# EAGLE design LocoNet-DCC Interface v2.0 (EAGLE 7.5.0)
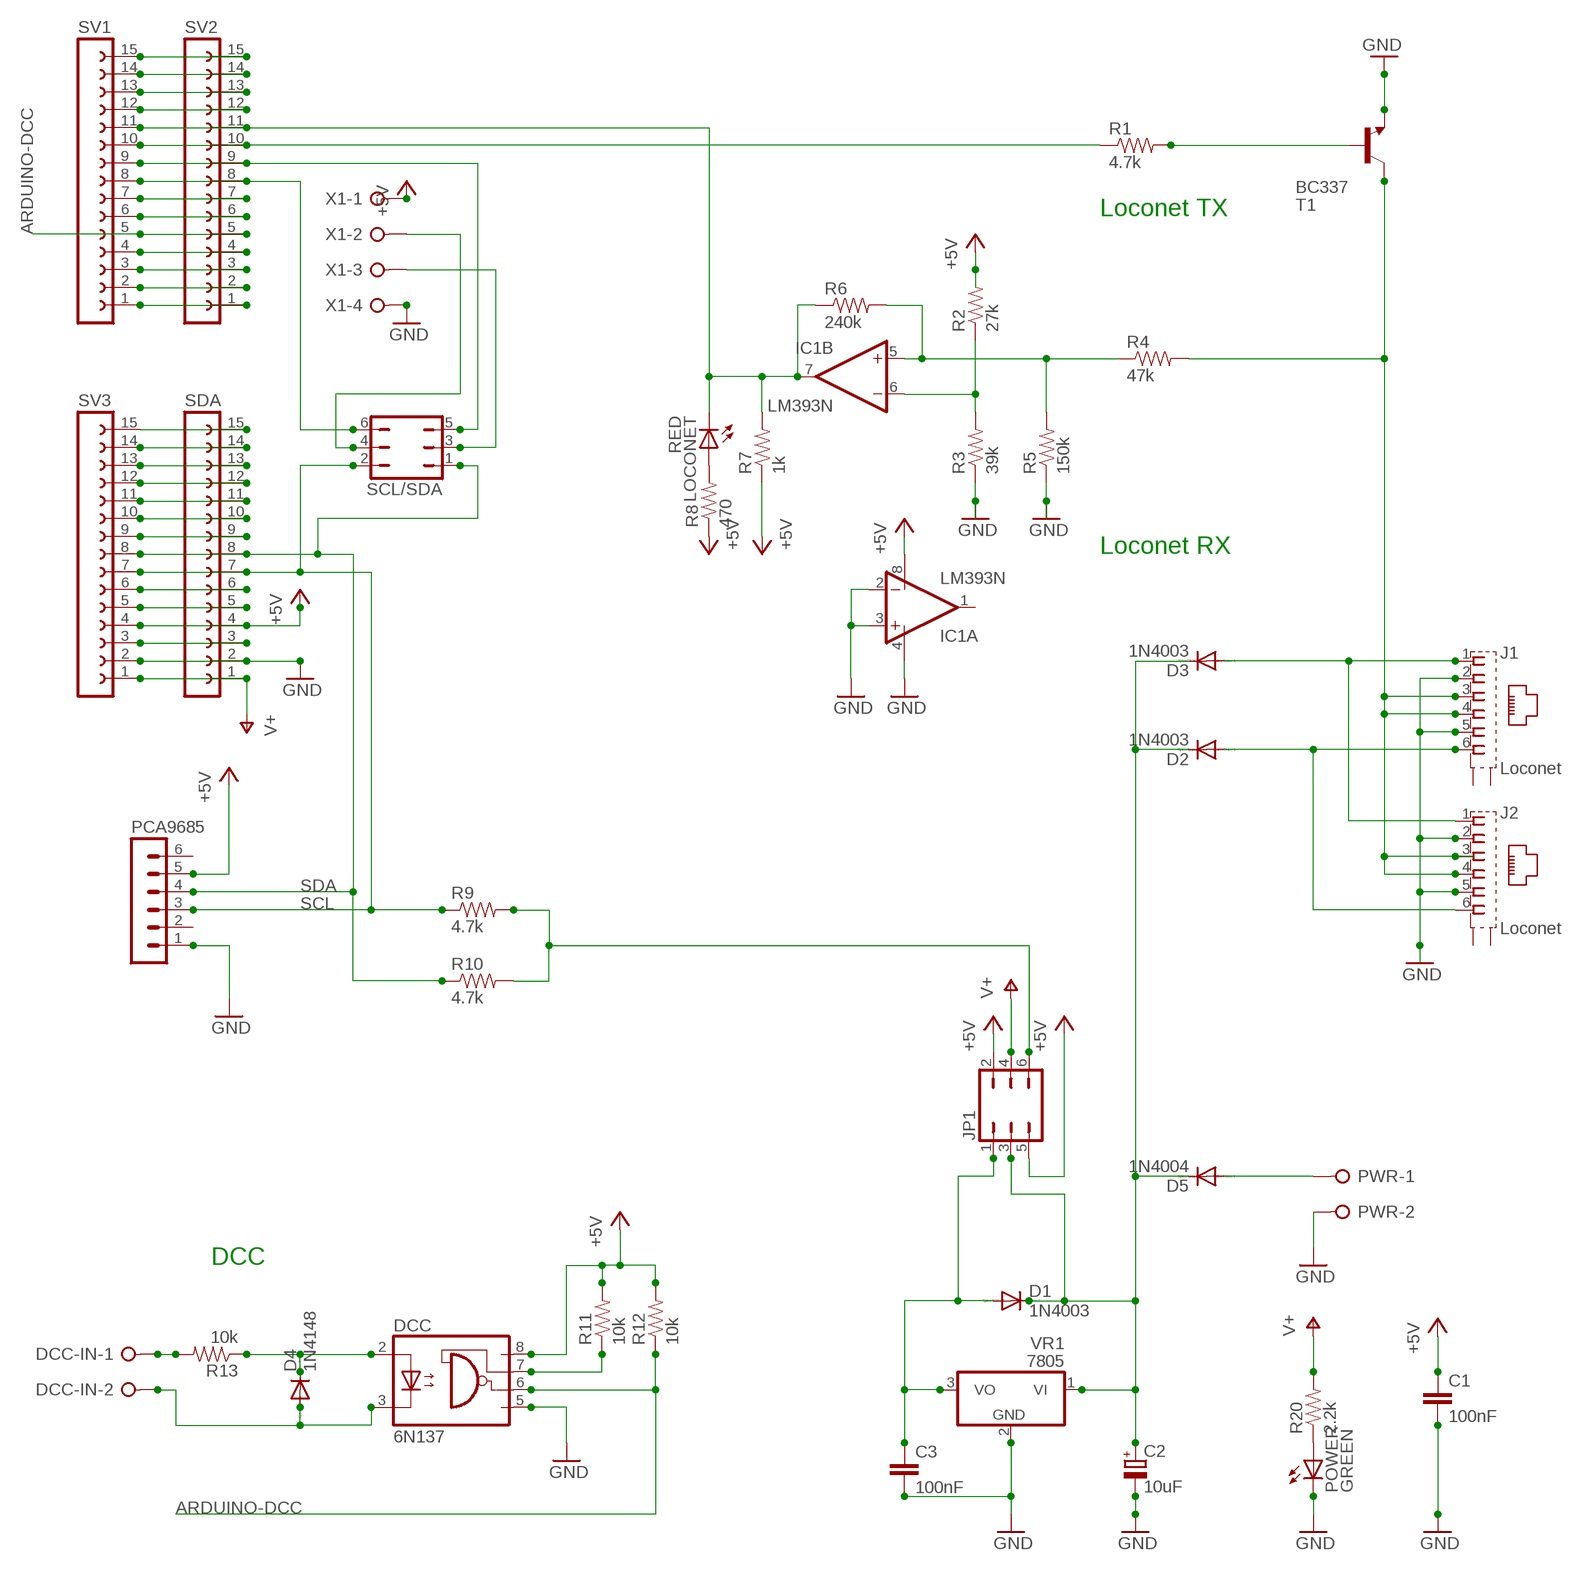
[diagram p0: schematic, sheet 1]

## Parts
C1  100nF  C-EU025_050-025X075  [C025_050-025X075]
C2  10uF  CPOL-EUE2.5-6  [E2,5-6]
C3  100nF  C-EU025_050-025X075  [C025_050-025X075]
D1  1N4003  1N4004  [DO41-10]
D2  1N4003  1N4004  [DO41-10]
D3  1N4003  1N4004  [DO41-10]
D4  1N4148  1N4148DO35-7  [DO35-7]
D5  1N4004  [DO41-10]
DCC  6N137  [DIL08]
DCC-IN  W237-02P  [W237-132]
IC1  LM393N  [DIL08]
J1  Loconet  555140-1  [555140-1]
J2  Loconet  555140-1  [555140-1]
JP1  JP3Q  [JP3Q]
LOCONET  RED  LED3MM  [LED3MM]
PCA9685  MA06-1  [MA06-1]
POWER  GREEN  LED3MM  [LED3MM]
PWR  W237-02P  [W237-132]
R1  4.7k  RESISTORAXIAL-0.3  [AXIAL-0.3]
R2  27k  RESISTORAXIAL-0.3  [AXIAL-0.3]
R3  39k  RESISTORAXIAL-0.3  [AXIAL-0.3]
R4  47k  RESISTORAXIAL-0.3  [AXIAL-0.3]
R5  150k  RESISTORAXIAL-0.3  [AXIAL-0.3]
R6  240k  RESISTORAXIAL-0.3  [AXIAL-0.3]
R7  1k  RESISTORAXIAL-0.3  [AXIAL-0.3]
R8  470  RESISTORAXIAL-0.3  [AXIAL-0.3]
R9  4.7k  RESISTORAXIAL-0.3  [AXIAL-0.3]
R10  4.7k  RESISTORAXIAL-0.3  [AXIAL-0.3]
R11  10k  RESISTORAXIAL-0.3  [AXIAL-0.3]
R12  10k  RESISTORAXIAL-0.3  [AXIAL-0.3]
R13  10k  RESISTORAXIAL-0.3  [AXIAL-0.3]
R20  2.2k  RESISTORAXIAL-0.3  [AXIAL-0.3]
SCL/SDA  JP3Q  [JP3Q]
SDA  FE15-1NOTEXT  [FE15]
SV1  FE15-1NOTEXT  [FE15]
SV2  FE15-1NOTEXT  [FE15]
SV3  FE15-1NOTEXT  [FE15]
T1  BC337  [TO92]
VR1  7805  7805TV  [TO220V]
X1  W237-04P  [W237-4P]

## Nets
3V3: SDA.14 SV3.14
+5V [5v]: C1.1 DCC.8(VCC) IC1.8(P:V+) JP1.2 JP1.5 PCA9685.5 R2.P$2 R7.P$1 R8.P$1 R11.P$2 R12.P$2 SDA.4 SV3.4 X1.1
A0: SDA.12 SV3.12
A1: SDA.11 SV3.11
A2: SDA.10 SV3.10
A3: SDA.9 SV3.9
A6: SDA.6 SV3.6
A7: SDA.5 SV3.5
ARDUINO-DCC: DCC.6(VO) R12.P$1 SV1.5 SV2.5
AREF: SDA.13 SV3.13
GND [ground]: C1.2 C2.- C3.2 DCC.5(GND) IC1.2(A:-IN) IC1.3(A:+IN) IC1.4(P:V-) J1.2 J1.5 J2.2 J2.5 PCA9685.1 POWER.K(C) PWR.2 R3.P$1 R5.P$1 SDA.2 SV3.2 T1.1(E) VR1.2(GND) X1.4
I2C_PULLUP: JP1.6 R9.P$2 R10.P$2
L-RX: IC1.7(B:OUT) LOCONET.K(C) R6.P$1 R7.P$2 SV1.11 SV2.11
L-TX: R1.P$1 SV1.10 SV2.10
LOCONET-SIGNAL [Loconet]: J1.3 J1.4 J2.3 J2.4 R4.P$2 T1.3(C)
N$1 [Vin]: D5.A PWR.1
N$5: POWER.A R20.P$1
N$7: LOCONET.A R8.P$2
N$8: R1.P$2 T1.2(B)
N$10: IC1.6(B:-IN) R2.P$1 R3.P$2
N$11: IC1.5(B:+IN) R4.P$1 R5.P$2 R6.P$2
N$14: SDA.3 SV3.3
N$30: SV1.4 SV2.4
N$37 [DCC]: D4.C DCC.2(A) R13.P$1
N$42 [DCC]: D4.A DCC-IN.2 DCC.3(C)
N$43: DCC.7(VE) R11.P$1
N$45 [DCC]: DCC-IN.1 R13.P$2
PIN3: SV1.6 SV2.6
PIN4: SV1.7 SV2.7
PIN5: SCL/SDA.6 SV1.8 SV2.8
PIN6: SCL/SDA.5 SV1.9 SV2.9
PIN9: SV1.12 SV2.12
PIN10: SV1.13 SV2.13
PIN11: SV1.14 SV2.14
PIN12: SV1.15 SV2.15
PIN13: SDA.15 SV3.15
RAILSYNC-A [Vin]: D3.A J1.1 J2.1
RAILSYNC-B [Vin]: D2.A J1.6 J2.6
RAILSYNC-VIN [Vin]: C2.+ D1.C D2.C D3.C D5.C JP1.3 VR1.1(VI)
RESET: SV1.3 SV2.3
RXD: SV1.2 SV2.2
SCL: PCA9685.3 R9.P$1 SCL/SDA.2 SDA.7 SV3.7
SDA: PCA9685.4 R10.P$1 SCL/SDA.1 SDA.8 SV3.8
TXD: SV1.1 SV2.1
V-OUT [5v]: C3.1 D1.A JP1.1 VR1.3(VO)
VIN [Vin]: JP1.4 R20.P$2 SDA.1 SV3.1 ; supply symbol labelled V+
X1-SCL/D5: SCL/SDA.4 X1.2
X1-SDA/D6: SCL/SDA.3 X1.3
Unconnected: IC1.1(A:OUT) J1.G1(S1) J1.G2(S2) J2.G1(S1) J2.G2(S2) PCA9685.2 PCA9685.6

## Notes on the sheet
- Loconet TX
- Loconet RX
- DCC

## Library data of the parts
C1 C3 = rcl:C-EU: CAPACITOR, European symbol
C2 = rcl:CPOL-EU: POLARIZED CAPACITOR, European symbol
D1-D3 D5 = diode:1N4004: DIODE general purpose rectifier, 1 A
D4 = diode:1N4148: DIODE high speed (Philips)
DCC = optocoupler:6N137: MOTOROLA OPTO COUPLER; MPN: 6N137; OC_FARNELL: 1328376; OC_NEWARK: 52M1895
DCC-IN PWR = con-wago-508:W237-02P: WAGO SREW CLAMP; OC_FARNELL: unknown; OC_NEWARK: unknown
IC1 = linear:LM393: COMPARATOR
J1 J2 = con-amp:555140-1: AMP connector
JP1 SCL/SDA = jumper:JP3Q: JUMPER
LOCONET POWER = led:LED: LED OSRAM: - CHIPLED LG R971, LG N971, LY N971, LG Q971, LY Q971, LO R971, LY R971 LH N974, LH R974 LS Q976, LO Q976, LY Q976 LO Q996 - Hyper CHIPLED LW Q18S LB Q993, LB Q99A, LB R99A - SideLED LS A670, LO A670, LY A670, LG A670, LP A670 LB A673, LV A673, LT A673, LW A673 LH A674 LY A675 LS A676, LA A676, LO A676, LY A676, LW A676 LS A679, LY A679, LG A679 - Hyper Micro SIDELED® LS Y876, LA Y876, LO Y876, LY Y876 LT Y87S - SmartLED LW L88C, LW L88S LB L89C, LB L89S, LG L890 LS L89K, LO L89K, LY L89K LS L896, LA L896, LO L896, LY L896 - TOPLED LS T670, LO T670, LY T670, LG T670, LP T670 LSG T670, LSP T670, LSY T670, LOP T670, LYG T670 LG T671, LOG T671, LSG T671 LB T673, LV T673, LT T673, LW T673 LH T674 LS T676, LA T676, LO T676, LY T676, LB T676, LH T676, LSB T676, LW T676 LB T67C, LV T67C, LT T67C, LS T67K, LO T67K, LY T67K, LW E67C LS E67B, LA E67B, LO E67B, LY E67B, LB E67C, LV E67C, LT E67C LW T67C LS T679, LY T679, LG T679 LS T770, LO T770, LY T770, LG T770, LP T770 LB T773, LV T773, LT T773, LW T773 LH T774 LS E675, LA E675, LY E675, LS T675 LS T776, LA T776, LO T776, LY T776, LB T776 LHGB T686 LT T68C, LB T68C - Hyper Mini TOPLED® LB M676 - Mini TOPLED Santana® LG M470 LS M47K, LO M47K, LY M47K Source: http://www.osram.convergy.de LUXEON: - LUMILED® LXK2-PW12-R00, LXK2-PW12-S00, LXK2-PW14-U00, LXK2-PW14-V00 LXK2-PM12-R00, LXK2-PM12-S00, LXK2-PM14-U00 LXK2-PE12-Q00, LXK2-PE12-R00, LXK2-PE12-S00, LXK2-PE14-T00, LXK2-PE14-U00 LXK2-PB12-K00, LXK2-PB12-L00, LXK2-PB12-M00, LXK2-PB14-N00, LXK2-PB14-P00, LXK2-PB14-Q00 LXK2-PR12-L00, LXK2-PR12-M00, LXK2-PR14-Q00, LXK2-PR14-R00 LXK2-PD12-Q00, LXK2-PD12-R00, LXK2-PD12-S00 LXK2-PH12-R00, LXK2-PH12-S00 LXK2-PL12-P00, LXK2-PL12-Q00, LXK2-PL12-R00 Source: www.luxeon.com KINGBRIGHT: KA-3528ASYC Source: www.kingbright.com
PCA9685 = con-lstb:MA06-1: PIN HEADER; OC_FARNELL: unknown; OC_NEWARK: unknown
R1-R13 R20 = SparkFun-Resistors:RESISTOR: Resistor Basic schematic elements and footprints for 0603, 1206, and PTH resistors.
SDA SV1-SV3 = con-lsta:FE15-1: FEMALE HEADER
T1 = transistor:BC337: NPN TRANSISTOR
VR1 = linear:78*: Positive VOLTAGE REGULATOR Source: http://cache.national.com/ds/LM/LM78L05.pdf http://www.fairchildsemi.com/ds/LM/LM7805.pdf
X1 = con-wago-508:W237-04P: WAGO SREW CLAMP; OC_FARNELL: unknown; OC_NEWARK: unknown

## Net classes
0 default: width 0.254 mm
1 ground: width 0.61 mm
2 5v: width 0.508 mm
3 Vin: width 0.61 mm
4 Loconet: width 0.508 mm
5 DCC: width 0.508 mm

## Board
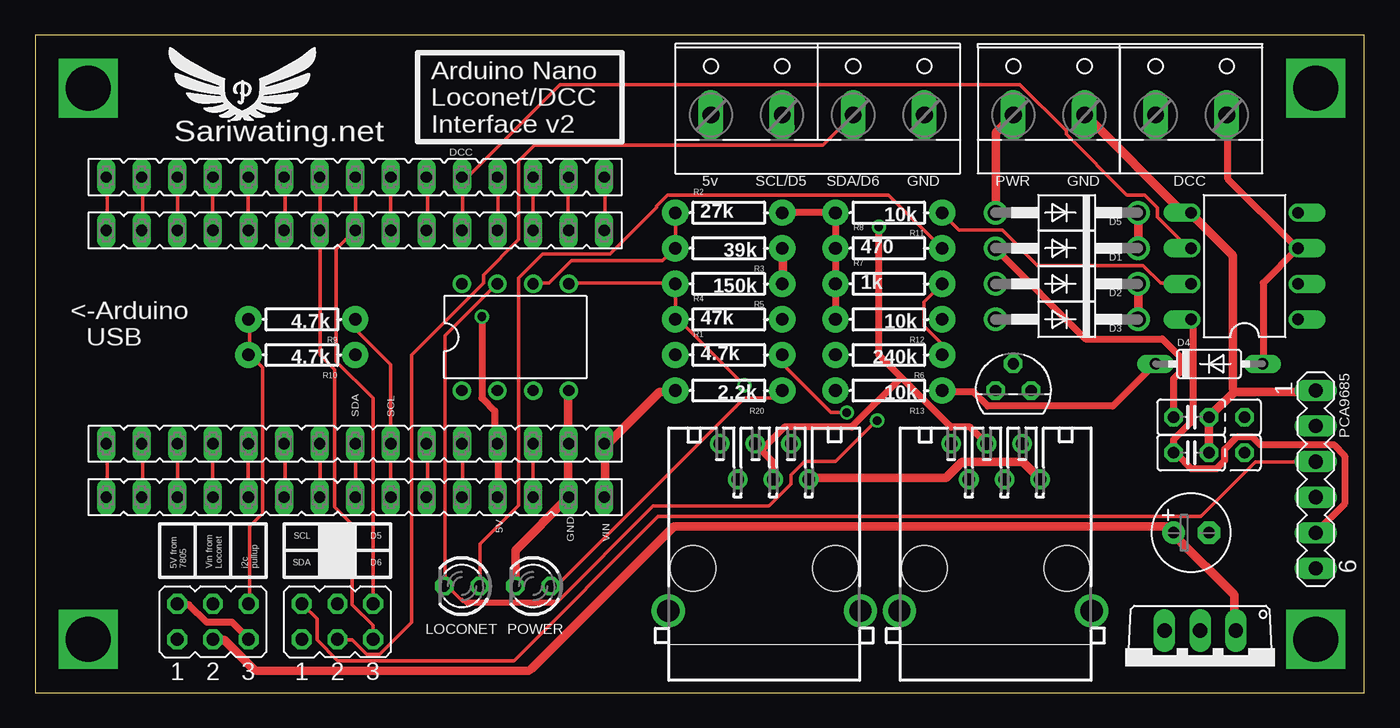
[diagram p1: board, top side]
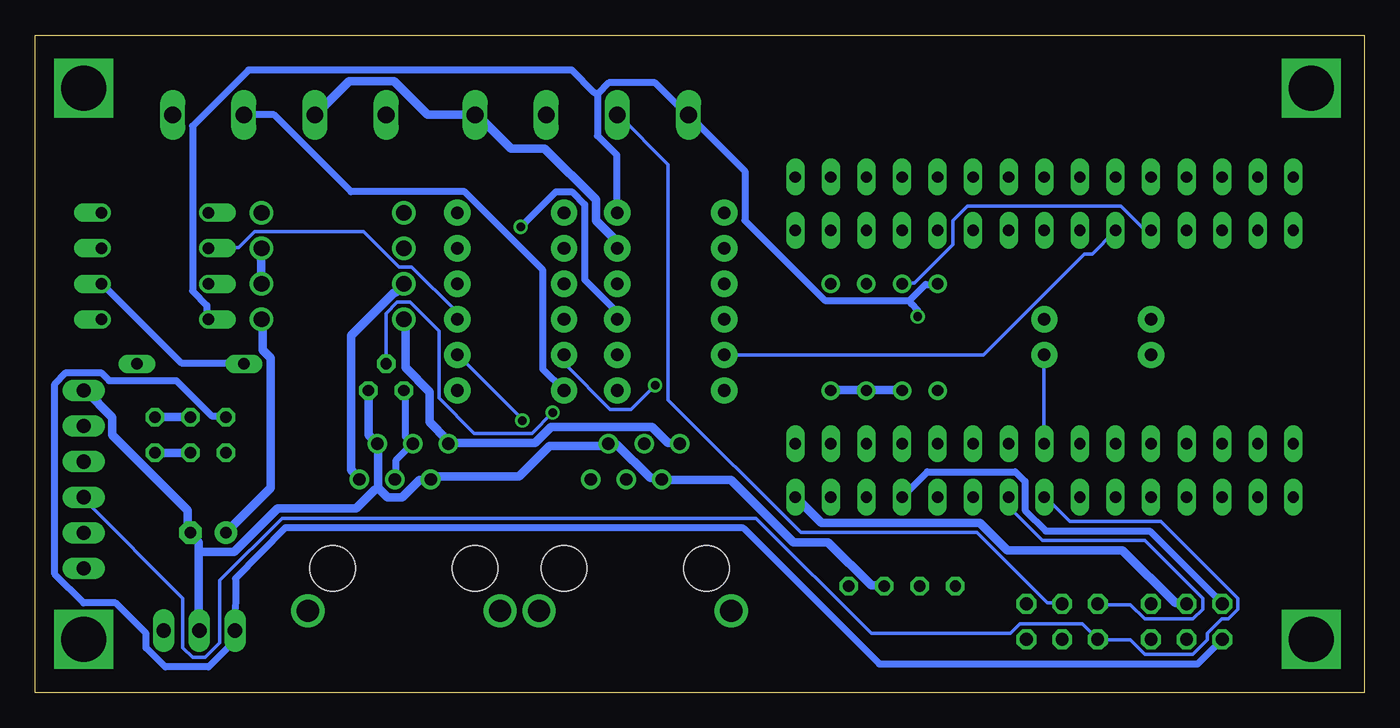
[diagram p2: board, bottom side, seen from below]

Size 94.92 x 46.98 mm. Coordinates in mm from the lower left corner, seen from the top.
Outline: 0,0 94.92,0 94.92,46.98 0,46.98 0,0
Copper layers (1*16): Top 0.035mm / dielectric 1.5mm / Bottom 0.035mm
Design rules "default": minimum track width 10mil, minimum drill 24mil, track to track 8mil, track to pad 8mil, pad to pad 8mil, via to via 8mil, smd to smd 8mil, copper to edge 40mil, drill to drill 8mil, minimum pad ring 10mil, minimum via ring 8mil, stop-mask expansion 4mil, vias tented up to drill 0mil, thermal gap 10mil

### Footprints (pad centres in the part's own frame; a part is rotated, then mirrored left to right if it is on the bottom)
C025_050-025X075 = drill 0.813 octagon: 1 -1.27,0; 2 1.27,0; 3 3.81,0
E2,5-6 = drill 0.813 pad 1.6: + -1.27,0 | drill 0.813 pad 1.6 octagon: - 1.27,0
DO41-10 = drill 1.118: A 5.08,0; C -5.08,0
DO35-7 = drill 0.813 long: A 3.81,0; C -3.81,0
DIL08 = drill 0.813 offset: 1 -3.81,-3.81; 2 -1.27,-3.81; 3 1.27,-3.81; 4 3.81,-3.81; 5 3.81,3.81; 6 1.27,3.81; 7 -1.27,3.81; 8 -3.81,3.81
W237-132 = drill 1.194 long: 1 -2.54,-0.635; 2 2.54,-0.635
DIL08' = drill 0.813 pad 1.27: 1 -3.81,-3.81; 2 -1.27,-3.81; 3 1.27,-3.81; 4 3.81,-3.81; 5 3.81,3.81; 6 1.27,3.81; 7 -1.27,3.81; 8 -3.81,3.81
555140-1 = drill 0.889: 1 -3.175,8.89; 2 -1.905,6.35; 3 -0.635,8.89; 4 0.635,6.35; 5 1.905,8.89; 6 3.175,6.35 | drill 1.575 pad 2.184: G1 -6.858,-3.048; G2 6.858,-3.048 | hole 3.251: -5.08,0; 5.08,0
JP3Q = drill 0.914 octagon: 1 -2.54,-1.27; 2 -2.54,1.27; 3 0,-1.27; 4 0,1.27; 5 2.54,-1.27; 6 2.54,1.27
LED3MM = drill 0.813 octagon: A -1.27,0; K 1.27,0
MA06-1 = drill 1.016 long: 1 -6.35,0; 2 -3.81,0; 3 -1.27,0; 4 1.27,0; 5 3.81,0; 6 6.35,0
AXIAL-0.3 = drill 0.9 pad 1.88: P$1 -3.81,0; P$2 3.81,0
FE15 = drill 0.813 long: 1 -17.78,0; 2 -15.24,0; 3 -12.7,0; 4 -10.16,0; 5 -7.62,0; 6 -5.08,0; 7 -2.54,0; 8 0,0; 9 2.54,0; 10 5.08,0; 11 7.62,0; 12 10.16,0; 13 12.7,0; 14 15.24,0; 15 17.78,0
TO92 = drill 0.813 octagon: 1 1.27,0; 2 0,1.905; 3 -1.27,0
TO220V = drill 1.016 long: 1 -2.54,-2.54; 2 0,-2.54; 3 2.54,-2.54
W237-4P = drill 1.194 long: 1 -7.62,-0.635; 2 -2.54,-0.635; 3 2.54,-0.635; 4 7.62,-0.635

### Placement (x,y rotation side)
C1  82.55,17.14 0 top
C2  82.55,11.43 0 top
C3  82.55,19.68 0 top
D1  73.66,31.75 180 top
D2  73.66,29.21 180 top
D3  73.66,26.67 180 top
D4  83.82,23.49 0 top
D5  73.66,34.29 180 top
DCC  86.36,30.48 90 top
DCC-IN  82.55,41.91 0 top
IC1  LM393N  [DIL08']  34.29,25.4 0 top
J1  68.58,8.89 0 top
J2  52.07,8.89 0 top
JP1  12.7,5.08 0 top
LOCONET  30.48,7.62 180 top
PCA9685  91.44,15.24 270 top
POWER  35.56,7.62 180 top
PWR  72.39,41.91 0 top
R1  49.53,24.13 0 top
R2  49.53,34.29 0 top
R3  49.53,31.75 180 top
R4  49.53,26.67 0 top
R5  49.53,29.21 180 top
R6  60.96,24.13 180 top
R7  60.96,29.21 0 top
R8  60.96,31.75 0 top
R9  19.05,26.67 180 top
R10  19.05,24.13 180 top
R11  60.96,34.29 180 top
R12  60.96,26.67 180 top
R13  60.96,21.59 180 top
R20  49.53,21.59 180 top
SCL/SDA  21.59,5.08 0 top
SDA  22.86,13.97 180 top
SV1  22.86,36.83 180 top
SV2  22.86,33.02 180 top
SV3  22.86,17.78 180 top
T1  69.85,21.59 0 top
VR1  83.19,1.9 180 top
X1  55.88,41.91 0 top

### Tracks (layer width: path | path; a pad name or v marks a point on that pad's centre or on a via)
3V3
  Top 0.254: SDA.14 7.67,14.07 7.67,17.73 SV3.14
+5V  (via drill 0.61)
  Top 0.508: DCC.8 82.65,26.64 82.65,19.44 81.28,18.07 81.28,17.16 C1.1 81.51,17.04 82.54,16.01 84.37,16.01 84.94,16.59 84.94,17.39 85.85,18.3 86.88,18.3 87.45,17.73 92.71,17.73 93.51,16.93 93.51,13.5 91.45,11.44 PCA9685.5 | R12.P$2 57.16,26.76 57.16,29.16 R7.P$1 57.16,29.39 57.16,31.56 R8.P$1 57.16,31.79 57.16,34.07 R11.P$2 57.05,34.3 53.39,34.3 R2.P$2 | JP1.2 10.18,6.3 10.99,6.3 12.24,5.04 14.07,5.04 15.21,3.9 JP1.5 | SDA.4 33.05,14.07 33.05,17.73 SV3.4 32.82,17.96 32.82,20.13 31.9,21.04 v31.9,26.87
  Bottom 0.508: 32.47,28.02 31.33,29.16 30.53,29.16 IC1.8 | 32.47,28.02 38.53,28.02 44.25,33.73 44.25,37.27 48.25,41.27 X1.1 48.48,41.39 50.65,43.56 53.96,43.56 54.76,42.76 | v31.9,26.87 31.9,27.33 32.36,27.79 32.47,28.02 | JP1.2 10.18,6.41 15.33,11.56 22.76,11.56 24.24,13.04 24.24,15.1 24.93,15.79 31.22,15.79 32.93,14.07 SDA.4 | 54.76,42.76 54.76,39.79 53.39,38.42 53.39,34.3 R2.P$2 | DCC.8 82.65,26.76 82.65,27.67 83.68,28.7 83.68,40.48 79.68,44.48 56.59,44.48 54.99,42.87 54.76,42.76
A0
  Top 0.254: SDA.12 12.7,14.07 12.7,17.73 SV3.12
A1
  Top 0.254: SDA.11 15.21,14.07 15.21,17.73 SV3.11
A2
  Top 0.254: SDA.10 17.84,14.07 17.84,17.73 SV3.10
A3
  Top 0.254: SDA.9 20.36,14.07 20.36,17.73 SV3.9
A6
  Top 0.254: SDA.6 28.02,14.07 28.02,17.73 SV3.6
A7
  Top 0.254: SDA.5 30.53,14.07 30.53,17.73 SV3.5
ARDUINO-DCC
  Top 0.254: SV2.5 30.53,33.04 30.53,36.82 SV1.5 30.64,36.82 30.87,36.82 37.5,43.45 70.31,43.45 73.62,40.13 73.62,39.9 77.96,35.56 79.22,35.56 80.14,34.65 80.14,33.96 82.31,31.79 82.54,31.79 DCC.6
  Bottom 0.254: DCC.6 82.54,31.79 80.37,31.79 79.22,32.93 71.45,32.93 68.94,30.42 68.02,30.42 64.82,27.22 64.82,26.76 R12.P$1
AREF
  Top 0.254: SDA.13 10.18,14.07 10.18,17.73 SV3.13
GND
  Top 0.61: POWER.K 34.3,7.67 34.3,10.18 38.08,13.96 SDA.2 38.08,14.19 38.08,17.73 SV3.2 38.08,18.07 38.08,21.5 IC1.4 | C1.2 83.8,17.16 83.8,19.67 C3.2 84.02,19.9 85.62,21.5 | 85.62,21.5 91.34,21.5 PCA9685.1 | R5.P$1 53.39,29.27 53.39,31.67 R3.P$1 | PWR.2 74.99,41.27 81.97,34.3 82.54,34.3 DCC.5 82.65,34.07 85.51,31.22 85.51,21.73 85.62,21.5
  Bottom 0.61: IC1.2 33.05,21.61 35.56,21.61 IC1.3 35.79,21.61 38.08,21.61 IC1.4 | T1.1 71.11,21.5 71.11,18.41 70.54,17.84 J1.5 70.42,17.5 70.42,14.64 | 70.42,14.64 69.74,13.96 68.71,13.96 67.45,15.21 66.76,15.21 J1.2 66.42,15.44 60.36,15.44 58.19,17.61 54.19,17.61 J2.5 53.96,17.73 53.39,17.73 50.99,15.33 50.19,15.33 J2.2 49.85,15.21 45.24,15.21 40.78,10.76 38.3,10.76 35.22,7.67 34.3,7.67 POWER.K | 83.22,10.07 83.22,10.76 83.8,11.33 C2.- 84.02,11.67 84.02,13.04 89.39,18.41 89.39,19.67 91.34,21.61 PCA9685.1 | 83.22,10.07 83.22,4.47 VR1.2 | PWR.2 74.88,41.27 72.48,43.67 69.28,43.67 66.88,41.27 63.56,41.27 X1.4 63.22,41.16 60.94,38.87 58.53,38.87 54.88,35.22 54.88,33.73 53.39,32.24 53.39,31.79 R3.P$1 | 70.42,14.64 70.65,14.53 72.01,13.17 77.61,13.17 80.71,10.07 82.99,10.07 83.22,10.07
I2C_PULLUP
  Top 0.254: JP1.6 15.33,6.41 15.33,11.9 16.24,12.81 16.24,23.22 15.33,24.13 R10.P$2 15.33,24.24 15.33,26.64 R9.P$2
L-RX  (via drill 0.61)
  Top 0.254: R6.P$1 64.71,24.13 64.71,24.93 63.45,26.19 63.45,27.9 64.71,29.16 R7.P$2 | SV2.11 15.21,33.04 15.21,36.82 SV1.11 | IC1.7 32.93,29.16 29.27,25.5 29.27,7.67 LOCONET.K 29.39,7.67 30.44,6.62 | 37.16,6.53 30.53,6.53 30.44,6.62 | v60.13,19.44 60.01,19.37 57.15,16.51 54.93,16.51 53.98,15.56 53.98,14.92 52.39,13.33 44.13,13.33 37.15,6.35 30.8,6.35 30.48,6.67 30.44,6.62
  Bottom 0.254: SV2.11 15.33,33.04 15.67,33.04 17.39,34.76 28.36,34.76 29.39,33.73 29.39,32.02 32.13,29.27 32.93,29.27 IC1.7 | v60.13,19.44 60.13,19.56 64.71,24.13 R6.P$1
L-TX
  Top 0.254: SV2.10 17.84,33.04 17.84,36.82 SV1.10
  Bottom 0.254: R1.P$1 45.62,24.13 27.22,24.13 20.02,31.33 19.44,31.33 17.84,32.93 SV2.10
LOCONET-SIGNAL  (via drill 0.61)
  Top 0.508: J2.4 52.71,15.33 52.71,16.47 51.45,17.73 J2.3 52.02,17.5 53.51,18.99 58.31,18.99 61.74,22.41 61.85,22.53 | v60.25,33.27 60.25,24.13 61.85,22.53 | 61.85,22.53 65.39,18.99 66.76,18.99 67.91,17.84 J1.3
  Bottom 0.508: T1.3 68.48,21.5 68.48,18.3 68.02,17.84 J1.3 68.13,17.61 69.16,16.59 69.16,15.33 J1.4 | v60.25,33.27 57.73,35.79 56.59,35.79 55.68,34.87 55.68,29.5 53.39,27.22 53.39,26.76 R4.P$2
N$1
  Top 0.61: PWR.1 68.59,40.02 68.59,34.3 D5.A
N$2  (via drill 3.2 pad 3.81)
  other vias: 91.44,43.18
N$3  (via drill 3.2 pad 3.81)
  other vias: 91.44,3.81
N$4  (via drill 3.2 pad 3.81)
  other vias: 3.81,3.81
N$5
  Top 0.254: POWER.A 36.93,7.67 37.28,7.67 50.65,21.04 52.82,21.04 53.28,21.5 R20.P$1
N$6  (via drill 3.2 pad 3.81)
  other vias: 3.81,43.18
N$7
  Top 0.254: LOCONET.A 31.79,7.67 31.79,10.64 34.53,13.39 34.53,29.62 36.25,31.33 41.05,31.33 44.36,34.65 44.36,34.76 45.16,35.56 60.94,35.56 64.71,31.79 R8.P$2
N$8  (via drill 0.61)
  Top 0.254: v57.96,20.01 56.82,20.01 53.39,23.44 53.39,24.13 R1.P$2
  Bottom 0.254: v57.96,20.01 59.45,18.53 63.56,18.53 66.08,21.04 66.08,25.84 68.13,27.9 69.05,27.9 69.85,27.1 69.85,23.56 T1.2
N$10
  Top 0.254: IC1.6 35.56,29.27 36.7,29.27 38.3,30.87 44.82,30.87 45.62,31.67 R3.P$2 45.73,31.79 45.73,34.19 R2.P$1
N$11  (via drill 0.61)
  Top 0.254: IC1.5 38.19,29.27 45.62,29.27 R5.P$2 45.73,29.16 45.73,26.76 R4.P$1 45.85,26.76 v50.65,21.96
  Bottom 0.254: v50.65,21.96 52.36,20.24 53.85,20.24 57.05,23.44 57.05,24.13 R6.P$2
N$14
  Top 0.254: SDA.3 35.56,14.07 35.56,17.73 SV3.3
N$30
  Top 0.254: SV2.4 33.05,33.04 33.05,36.82 SV1.4
N$37
  Top 0.508: R13.P$1 64.82,21.5 66.99,21.5 68.02,20.47 76.94,20.47 79.91,23.44 D4.C
  Bottom 0.508: D4.C 80.02,23.56 84.48,23.56 90.08,29.16 DCC.2
N$42
  Top 0.508: D4.A 87.68,23.56 87.68,29.27 90.08,31.67 DCC.3 89.97,31.9 85.17,36.7 85.17,41.27 DCC-IN.2
N$43
  Top 0.254: DCC.7 82.54,29.27 80.37,29.27 79.11,30.53 71.56,30.53 69.05,33.04 65.96,33.04 64.82,34.19 R11.P$1
N$45
  Bottom 0.508: DCC-IN.1 79.91,41.27 77.85,41.27 72.36,35.79 64.25,35.79 58.65,30.19 58.65,23.1 57.16,21.61 R13.P$2
PIN3
  Top 0.254: SV2.6 28.02,33.04 28.02,36.82 SV1.6
PIN4
  Top 0.254: SV2.7 25.39,33.04 25.39,36.82 SV1.7
PIN5
  Top 0.254: SV1.8 22.87,36.82 22.87,33.04 SV2.8 22.76,32.93 21.5,31.67 21.5,23.67 24.13,21.04 24.13,6.41 SCL/SDA.6
PIN6
  Top 0.254: SV1.9 20.36,36.82 20.36,33.04 SV2.9 20.36,32.93 20.36,24.13 21.39,23.1 21.39,13.27 22.64,12.01 22.64,6.3 24.13,4.81 24.13,3.9 SCL/SDA.5
PIN9
  Top 0.254: SV2.12 12.7,33.04 12.7,36.82 SV1.12
PIN10
  Top 0.254: SV2.13 10.18,33.04 10.18,36.82 SV1.13
PIN11
  Top 0.254: SV2.14 7.67,33.04 7.67,36.82 SV1.14
PIN12
  Top 0.254: SV2.15 5.16,33.04 5.16,36.82 SV1.15
PIN13
  Top 0.254: SDA.15 5.16,14.07 5.16,17.73 SV3.15
RAILSYNC-A
  Bottom 0.61: J2.1 48.93,17.84 49.73,17.84 50.88,18.99 58.08,18.99 59.22,17.84 65.39,17.84 J1.1 65.51,18.07 66.76,19.33 66.76,21.5 68.48,23.22 68.48,26.64 D3.A
RAILSYNC-B
  Top 0.61: J2.6 55.33,15.33 65.05,15.33 66.19,16.47 70.54,16.47 71.68,15.33 J1.6
  Bottom 0.61: D2.A 68.59,29.16 69.16,28.59 69.28,28.59 72.36,25.5 72.36,15.9 71.79,15.33 J1.6
RAILSYNC-VIN
  Top 0.61: D3.C 78.77,26.76 78.77,29.16 D2.C | D1.C 78.77,31.79 78.77,34.19 D5.C | JP1.3 12.7,3.78 13.5,3.78 15.67,1.61 15.88,1.59 35.24,1.59 35.45,1.73 45.62,11.9 45.81,11.9 80.82,11.9 81.28,11.44 C2.+ 81.39,11.21 85.62,6.98 85.62,4.47 VR1.1
  Bottom 0.61: D2.C 78.77,29.27 78.77,31.67 D1.C | D3.C 78.65,26.64 78.65,24.47 78.08,23.9 78.08,14.64 81.28,11.44 C2.+
RESET
  Top 0.254: SV2.3 35.56,33.04 35.56,36.82 SV1.3
RXD
  Top 0.254: SV2.2 38.08,33.04 38.08,36.82 SV1.2
SCL
  Top 0.254: SDA.7 25.39,14.07 25.39,17.73 SV3.7 25.39,17.84 25.39,23.44 22.87,25.96 22.87,26.64 R9.P$1 | PCA9685.3 91.34,16.47 87.11,16.47 83.22,12.59 44.49,12.59 34.2,2.3 21.61,2.3 20.13,3.78 20.13,5.27 19.1,6.3 SCL/SDA.2
  Bottom 0.254: SCL/SDA.2 18.99,6.3 16.7,6.3 15.67,5.27 12.24,5.27 11.56,5.96 11.56,6.76 15.67,10.87 22.99,10.87 25.39,13.27 25.39,13.96 SDA.7
SDA
  Top 0.254: SDA.8 22.87,14.07 22.87,17.73 SV3.8
  Bottom 0.254: SDA.8 22.76,13.96 21.04,12.24 14.53,12.24 9.04,6.76 9.04,5.96 9.73,5.27 10.18,5.27 11.21,4.24 11.21,3.78 12.24,2.76 15.67,2.76 16.7,3.78 18.99,3.78 SCL/SDA.1 19.1,3.9 20.13,4.93 24.59,4.93 25.27,4.24 25.39,4.24 35.22,4.24 43.45,12.47 77.28,12.47 81.74,8.01 81.74,3.67 81.74,3.56 82.77,2.53 83.68,2.53 84.37,3.21 84.37,6.76 91.34,13.73 91.34,13.96 PCA9685.4 | R10.P$1 22.87,24.13 22.87,17.84 SV3.8
TXD
  Top 0.254: SV2.1 40.7,33.04 40.7,36.82 SV1.1
V-OUT
  Top 0.508: C3.1 81.28,22.41 81.85,22.99 81.85,23.9 80.48,25.27 74.99,25.27 68.59,31.67 D1.A
  Bottom 0.508: JP1.1 11.9,2.07 12.13,2.07 34.65,2.07 44.25,11.67 44.45,11.81 77.04,11.81 80.59,8.17 VR1.3 80.48,3.9 82.54,1.84 85.62,1.84 86.99,3.21 86.99,4.24 89.17,6.41 91.45,6.41 93.51,8.47 93.51,22.07 92.71,22.87 90.19,22.87 89.62,22.3 84.82,22.3 82.31,19.79 81.28,19.79 C3.1
VIN
  Top 0.61: SDA.1 40.7,14.07 40.7,17.73 SV3.1 40.93,17.84 44.59,21.5 45.62,21.5 R20.P$2
  Bottom 0.61: JP1.4 12.7,6.41 13.5,6.41 17.27,10.18 25.5,10.18 27.45,12.13 38.76,12.13 40.59,13.96 SDA.1
X1-SCL/D5
  Bottom 0.254: SCL/SDA.4 21.61,6.41 22.64,6.41 27.67,11.44 40.25,11.44 49.73,20.93 49.73,37.73 53.28,41.27 X1.2
X1-SDA/D6
  Top 0.254: X1.3 56.25,39.1 35.67,39.1 34.53,37.96 34.53,32.36 32.02,29.84 32.02,29.27 26.87,24.13 26.87,5.04 24.59,2.76 23.67,2.76 22.64,3.78 21.61,3.78 SCL/SDA.3

### Text on the board
tPlace: Sariwating.net | Arduino Nano / Loconet/DCC / Interface v2
tNames: DCC | 5v | SCL/D5 | SDA/D6 | GND | PWR | GND | DCC | <-Arduino / USB | SDA | SCL | SCL | D5 | 5V | GND | VIN | SDA | D6 | 5V from / 7805 | Vin from / Loconet | i2c / pullup